# EAGLE design seismo (EAGLE 7.2.0)
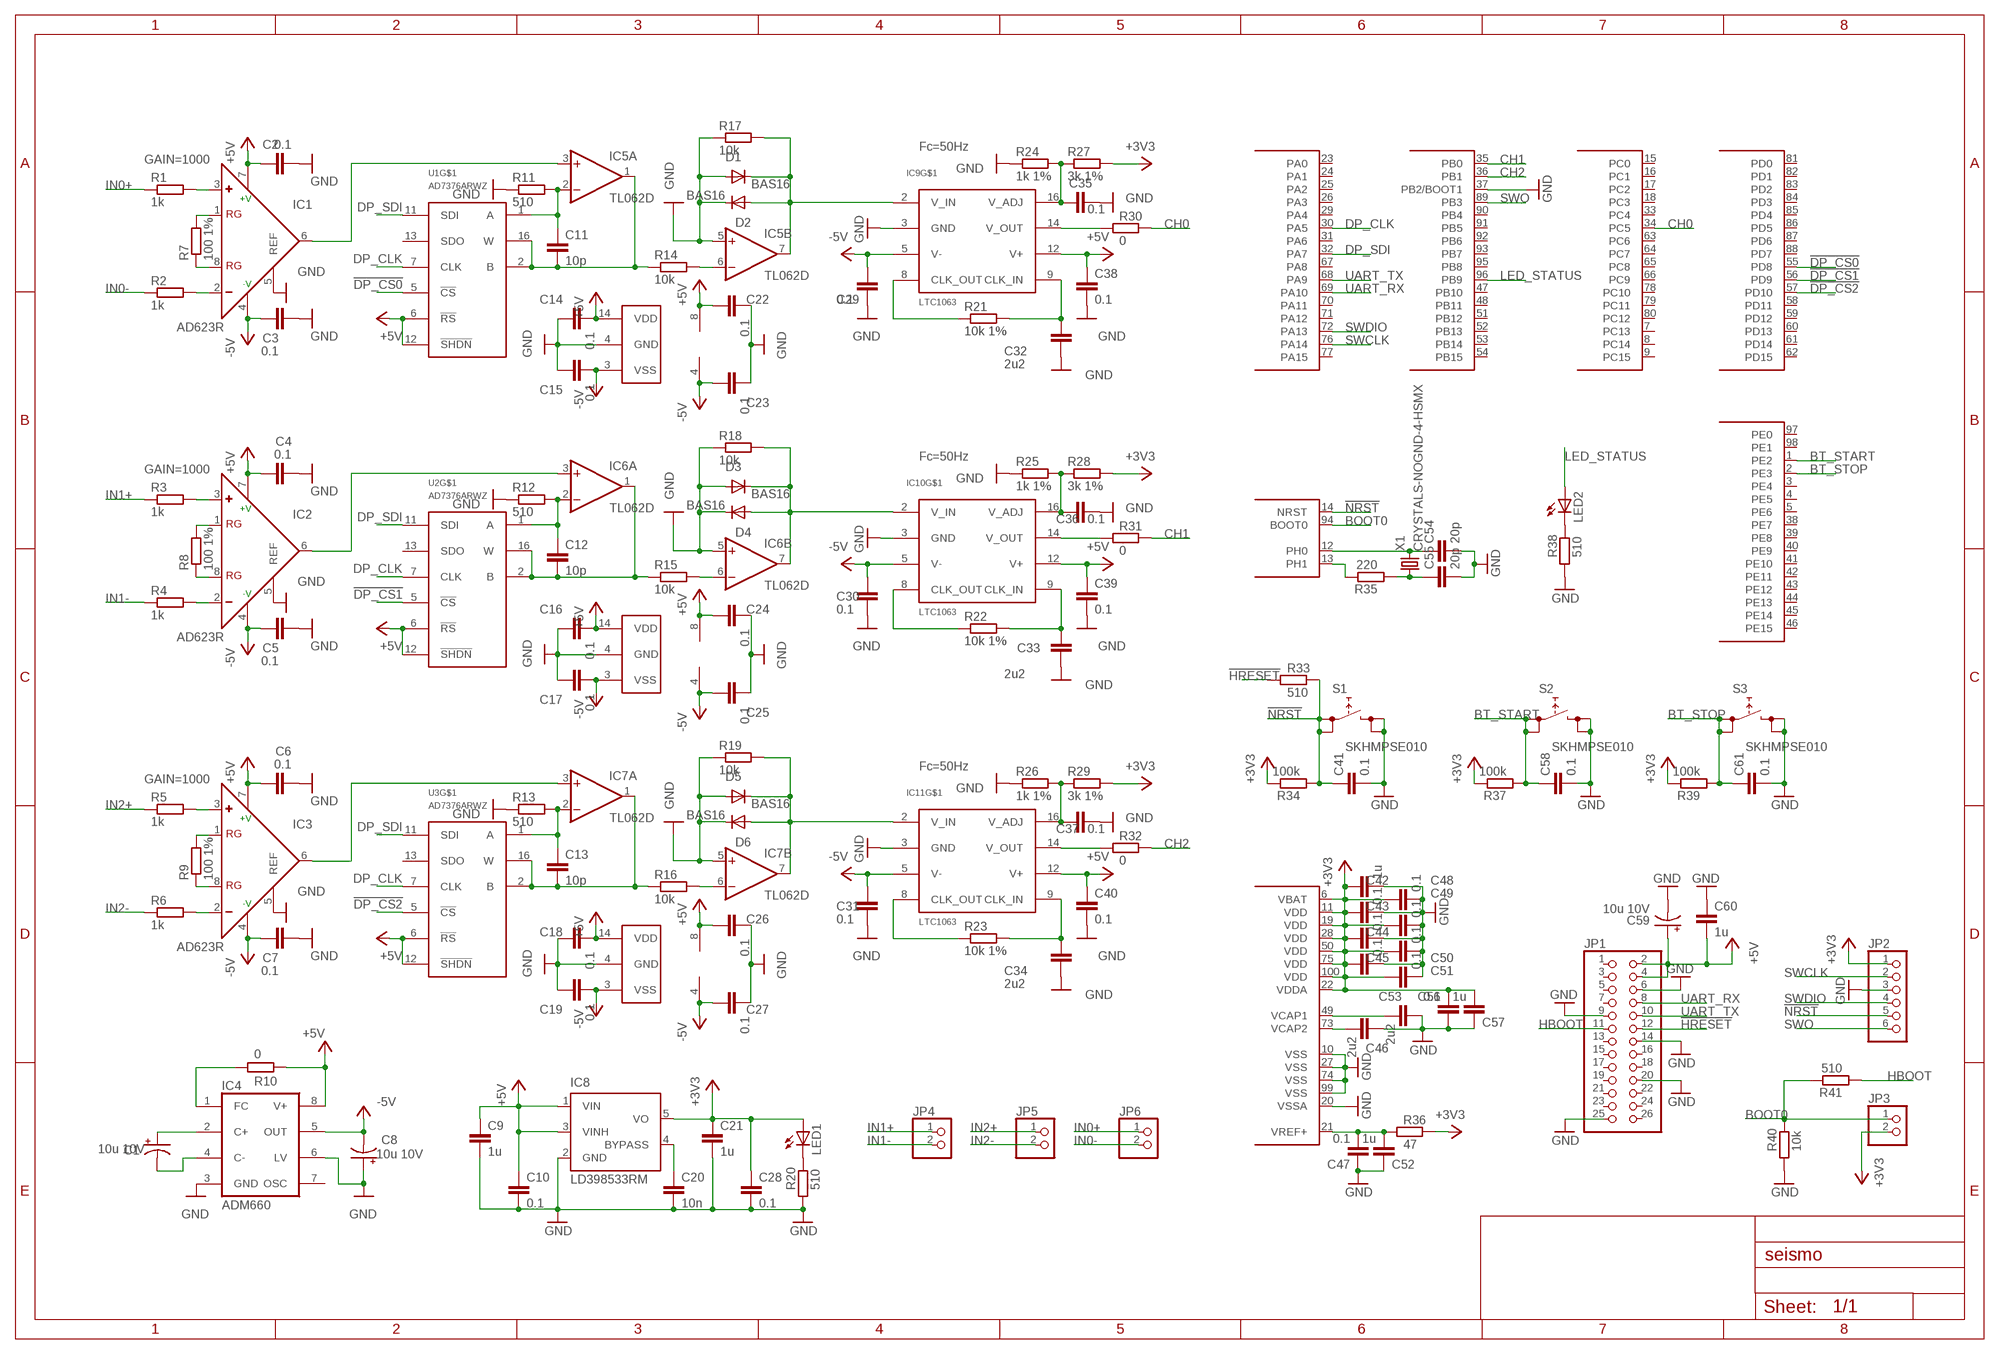
[diagram p0: schematic, sheet 1]

## Parts
C1  10u 10V  CPOL-USSMCA  [SMC_A]
C2  0.1  C-EUC0805  [C0805]
C3  0.1  C-EUC0805  [C0805]
C4  0.1  C-EUC0805  [C0805]
C5  0.1  C-EUC0805  [C0805]
C6  0.1  C-EUC0805  [C0805]
C7  0.1  C-EUC0805  [C0805]
C8  10u 10V  CPOL-USSMCA  [SMC_A]
C9  1u  C-EUC0805  [C0805]
C10  0.1  C-EUC0805  [C0805]
C11  10p  C-EUC0805  [C0805]
C12  10p  C-EUC0805  [C0805]
C13  10p  C-EUC0805  [C0805]
C14  0.1  C-EUC0805  [C0805]
C15  0.1  C-EUC0805  [C0805]
C16  0.1  C-EUC0805  [C0805]
C17  0.1  C-EUC0805  [C0805]
C18  0.1  C-EUC0805  [C0805]
C19  0.1  C-EUC0805  [C0805]
C20  10n  C-EUC0805  [C0805]
C21  1u  C-EUC0805  [C0805]
C22  0.1  C-EUC0805  [C0805]
C23  0.1  C-EUC0805  [C0805]
C24  0.1  C-EUC0805  [C0805]
C25  0.1  C-EUC0805  [C0805]
C26  0.1  C-EUC0805  [C0805]
C27  0.1  C-EUC0805  [C0805]
C28  0.1  C-EUC0805  [C0805]
C29  0.1  C-EUC0805  [C0805]
C30  0.1  C-EUC0805  [C0805]
C31  0.1  C-EUC0805  [C0805]
C32  2u2  C-EUC0805  [C0805]
C33  2u2  C-EUC0805  [C0805]
C34  2u2  C-EUC0805  [C0805]
C35  0.1  C-EUC0805  [C0805]
C36  0.1  C-EUC0805  [C0805]
C37  0.1  C-EUC0805  [C0805]
C38  0.1  C-EUC0805  [C0805]
C39  0.1  C-EUC0805  [C0805]
C40  0.1  C-EUC0805  [C0805]
C41  0.1  C-EUC0805  [C0805]
C42  1u  C-EUC0805  [C0805]
C43  0.1  C-EUC0805  [C0805]
C44  0.1  C-EUC0805  [C0805]
C45  0.1  C-EUC0805  [C0805]
C46  2u2  C-EUC0805  [C0805]
C47  0.1  C-EUC0805  [C0805]
C48  0.1  C-EUC0805  [C0805]
C49  0.1  C-EUC0805  [C0805]
C50  0.1  C-EUC0805  [C0805]
C51  0.1  C-EUC0805  [C0805]
C52  1u  C-EUC0805  [C0805]
C53  2u2  C-EUC0805  [C0805]
C54  20p  C-EUC0805  [C0805]
C55  20p  C-EUC0805  [C0805]
C56  0.1  C-EUC0805  [C0805]
C57  1u  C-EUC0805  [C0805]
C58  0.1  C-EUC0805  [C0805]
C59  10u 10V  CPOL-USSMCA  [SMC_A]
C60  1u  C-EUC0805  [C0805]
C61  0.1  C-EUC0805  [C0805]
D1  BAS16  [SOT23]
D2  BAS16  [SOT23]
D3  BAS16  [SOT23]
D4  BAS16  [SOT23]
D5  BAS16  [SOT23]
D6  BAS16  [SOT23]
IC1  AD623R  [SO8]
IC2  AD623R  [SO8]
IC3  AD623R  [SO8]
IC4  ADM660  [SO8]
IC5  TL062D  [SO08]
IC6  TL062D  [SO08]
IC7  TL062D  [SO08]
IC8  LD398533RM  [SOT23-5L]
IC9  LTC1063  [SOIC127P1032X264-16N]
IC10  LTC1063  [SOIC127P1032X264-16N]
IC11  LTC1063  [SOIC127P1032X264-16N]
JP1  PINHD-2X13  [2X13]
JP2  PINHD-1X6  [1X06]
JP3  PINHD-1X2  [1X02]
JP4  PINHD-1X2  [1X02]
JP5  PINHD-1X2  [1X02]
JP6  PINHD-1X2  [1X02]
LED1  LEDCHIPLED_1206  [CHIPLED_1206]
LED2  LEDCHIPLED_1206  [CHIPLED_1206]
R1  1k  R-EU_R0805W  [R0805W]
R2  1k  R-EU_R0805W  [R0805W]
R3  1k  R-EU_R0805W  [R0805W]
R4  1k  R-EU_R0805W  [R0805W]
R5  1k  R-EU_R0805W  [R0805W]
R6  1k  R-EU_R0805W  [R0805W]
R7  100 1%  R-EU_R0805W  [R0805W]
R8  100 1%  R-EU_R0805W  [R0805W]
R9  100 1%  R-EU_R0805W  [R0805W]
R10  0  R-EU_R0805W  [R0805W]
R11  510  R-EU_R0805W  [R0805W]
R12  510  R-EU_R0805W  [R0805W]
R13  510  R-EU_R0805W  [R0805W]
R14  10k  R-EU_R0805W  [R0805W]
R15  10k  R-EU_R0805W  [R0805W]
R16  10k  R-EU_R0805W  [R0805W]
R17  10k  R-EU_R0805W  [R0805W]
R18  10k  R-EU_R0805W  [R0805W]
R19  10k  R-EU_R0805W  [R0805W]
R20  510  R-EU_R0805W  [R0805W]
R21  10k 1%  R-EU_R0805W  [R0805W]
R22  10k 1%  R-EU_R0805W  [R0805W]
R23  10k 1%  R-EU_R0805W  [R0805W]
R24  1k 1%  R-EU_R0805W  [R0805W]
R25  1k 1%  R-EU_R0805W  [R0805W]
R26  1k 1%  R-EU_R0805W  [R0805W]
R27  3k 1%  R-EU_R0805W  [R0805W]
R28  3k 1%  R-EU_R0805W  [R0805W]
R29  3k 1%  R-EU_R0805W  [R0805W]
R30  0  R-EU_R0805W  [R0805W]
R31  0  R-EU_R0805W  [R0805W]
R32  0  R-EU_R0805W  [R0805W]
R33  510  R-EU_R0805W  [R0805W]
R34  100k  R-EU_R0805W  [R0805W]
R35  220  R-EU_R0805W  [R0805W]
R36  47  R-EU_R0805W  [R0805W]
R37  100k  R-EU_R0805W  [R0805W]
R38  510  R-EU_R0805W  [R0805W]
R39  100k  R-EU_R0805W  [R0805W]
R40  10k  R-EU_R0805W  [R0805W]
R41  510  R-EU_R0805W  [R0805W]
S1  SKHMPSE010  [SKHMPXE010]
S2  SKHMPSE010  [SKHMPXE010]
S3  SKHMPSE010  [SKHMPXE010]
U1  AD7376ARWZ  [SO-16W]
U2  AD7376ARWZ  [SO-16W]
U3  AD7376ARWZ  [SO-16W]
U4  STM32F4-100  [SQFP-S-14X14-100]
X1  CRYSTALS-NOGND-4-HSMX  [HC49-4-HSMX]

## Nets
!DP_CS0: U1.5(!CS) U4.55(PD8)
!DP_CS1: U2.5(!CS) U4.56(PD9)
!DP_CS2: U3.5(!CS) U4.57(PD10)
!HRESET: JP1.12 R33.1
!NRST: C41.1 JP2.5 R33.2 R34.1 S1.1(1.1) S1.2(1.2) U4.14(NRST)
+3V3: C21.1 C28.1 C42.1 C43.1 C44.1 C45.1 C48.1 C49.1 C50.1 C51.1 C56.2 C57.2 IC8.5(VO) JP2.1 JP3.2 LED1.A R27.2 R28.2 R29.2 R34.2 R36.2 R37.2 R39.2 U4.6(VBAT) U4.11(VDD) U4.19(VDD) U4.22(VDDA) U4.28(VDD) U4.50(VDD) U4.75(VDD) U4.100(VDD)
+5V: C2.1 C4.1 C6.1 C9.1 C10.1 C14.2 C16.2 C18.2 C22.1 C24.1 C26.1 C38.1 C39.1 C40.1 C59.+ C60.2 IC1.7(+V) IC2.7(+V) IC3.7(+V) IC4.8(V+) IC5.8(P:V+) IC6.8(P:V+) IC7.8(P:V+) IC8.1(VIN) IC8.3(VINH) IC9.12(V+) IC10.12(V+) IC11.12(V+) JP1.2 JP1.4 R10.2 U1.6(!RS) U1.12(!SHDN) U1.14(VDD) U2.6(!RS) U2.12(!SHDN) U2.14(VDD) U3.6(!RS) U3.12(!SHDN) U3.14(VDD)
-5V: C3.1 C5.1 C7.1 C8.- C15.2 C17.2 C19.2 C23.1 C25.1 C27.1 C29.1 C30.1 C31.1 IC1.4(-V) IC2.4(-V) IC3.4(-V) IC4.5(OUT) IC5.4(P:V-) IC6.4(P:V-) IC7.4(P:V-) IC9.5(V-) IC10.5(V-) IC11.5(V-) U1.3(VSS) U2.3(VSS) U3.3(VSS)
BOOT0: JP3.1 R40.2 R41.2 U4.94(BOOT0)
BT_START: C58.1 R37.1 S2.1(1.1) S2.2(1.2) U4.1(PE2)
BT_STOP: C61.1 R39.1 S3.1(1.1) S3.2(1.2) U4.2(PE3)
CH0: R30.2 U4.34(PC5)
CH1: R31.2 U4.35(PB0)
CH2: R32.2 U4.36(PB1)
DP_CLK: U1.7(CLK) U2.7(CLK) U3.7(CLK) U4.30(PA5)
DP_SDI: U1.11(SDI) U2.11(SDI) U3.11(SDI) U4.32(PA7)
GND: C2.2 C3.2 C4.2 C5.2 C6.2 C7.2 C8.+ C9.2 C10.2 C14.1 C15.1 C16.1 C17.1 C18.1 C19.1 C20.2 C21.2 C22.2 C23.2 C24.2 C25.2 C26.2 C27.2 C28.2 C29.2 C30.2 C31.2 C32.2 C33.2 C34.2 C35.2 C36.2 C37.2 C38.2 C39.2 C40.2 C41.2 C42.2 C43.2 C44.2 C45.2 C46.1 C47.1 C48.2 C49.2 C50.2 C51.2 C52.1 C53.1 C54.2 C55.2 C56.1 C57.1 C58.2 C59.- C60.1 C61.2 D1.1(A) D2.3(C) D3.1(A) D4.3(C) D5.1(A) D6.3(C) IC1.5(REF) IC2.5(REF) IC3.5(REF) IC4.3(GND) IC4.6(LV) IC5.5(B:+IN) IC6.5(B:+IN) IC7.5(B:+IN) IC8.2(GND) IC9.3(GND) IC10.3(GND) IC11.3(GND) JP1.6 JP1.9 JP1.14 JP1.20 JP1.25 JP2.3 R11.1 R12.1 R13.1 R17.1 R18.1 R19.1 R20.1 R24.1 R25.1 R26.1 R38.1 R40.1 S1.3(2.1) S1.4(2.2) S2.3(2.1) S2.4(2.2) S3.3(2.1) S3.4(2.2) U1.4(GND) U2.4(GND) U3.4(GND) U4.10(VSS) U4.20(VSSA) U4.27(VSS) U4.37(PB2/BOOT1) U4.74(VSS) U4.99(VSS)
HBOOT: JP1.11 R41.1
IN0+: JP6.1 R1.1
IN0-: JP6.2 R2.1
IN1+: JP4.1 R3.1
IN1-: JP4.2 R4.1
IN2+: JP5.1 R5.1
IN2-: JP5.2 R6.1
LED_STATUS: LED2.A U4.96(PB9)
N$1: IC1.2(-) R2.2
N$2: IC1.8(RG) R7.1
N$3: IC1.1(RG) R7.2
N$4: IC1.3(+) R1.2
N$5: C55.1 R35.1 X1.1
N$6: IC9.8(CLK_OUT) R21.1
N$7: C32.1 IC9.9(CLK_IN) R21.2
N$8: C35.1 IC9.16(V_ADJ) R24.2 R27.1
N$9: R35.2 U4.13(PH1)
N$10: IC9.14(V_OUT) R30.1
N$11: C1.+ IC4.2(C+)
N$12: IC10.8(CLK_OUT) R22.1
N$13: C33.1 IC10.9(CLK_IN) R22.2
N$14: IC2.2(-) R4.2
N$15: IC2.8(RG) R8.1
N$16: IC2.1(RG) R8.2
N$17: IC2.3(+) R3.2
N$18: C36.1 IC10.16(V_ADJ) R25.2 R28.1
N$19: IC10.14(V_OUT) R31.1
N$20: C1.- IC4.4(C-)
N$21: C53.2 U4.49(VCAP1)
N$22: IC11.8(CLK_OUT) R23.1
N$23: C34.1 IC11.9(CLK_IN) R23.2
N$24: IC3.2(-) R6.2
N$25: IC3.8(RG) R9.1
N$26: IC3.1(RG) R9.2
N$27: IC3.3(+) R5.2
N$28: C37.1 IC11.16(V_ADJ) R26.2 R29.1
N$29: IC11.14(V_OUT) R32.1
N$30: IC4.1(FC) R10.1
N$31: C11.2 IC5.1(A:OUT) R14.1 U1.2(B) U1.16(W)
N$32: IC1.6(OUT) IC5.3(A:+IN)
N$33: C11.1 IC5.2(A:-IN) R11.2 U1.1(A)
N$34: IC5.6(B:-IN) R14.2
N$35: C20.1 IC8.4(BYPASS)
N$36: D1.3(C) D2.1(A) IC5.7(B:OUT) IC9.2(V_IN) R17.2
N$37: C46.2 U4.73(VCAP2)
N$40: C12.2 IC6.1(A:OUT) R15.1 U2.2(B) U2.16(W)
N$41: IC2.6(OUT) IC6.3(A:+IN)
N$42: C12.1 IC6.2(A:-IN) R12.2 U2.1(A)
N$43: IC6.6(B:-IN) R15.2
N$44: D3.3(C) D4.1(A) IC6.7(B:OUT) IC10.2(V_IN) R18.2
N$47: C13.2 IC7.1(A:OUT) R16.1 U3.2(B) U3.16(W)
N$48: IC3.6(OUT) IC7.3(A:+IN)
N$49: C13.1 IC7.2(A:-IN) R13.2 U3.1(A)
N$50: IC7.6(B:-IN) R16.2
N$51: D5.3(C) D6.1(A) IC7.7(B:OUT) IC11.2(V_IN) R19.2
N$54: C54.1 U4.12(PH0) X1.2
N$56: LED1.C R20.2
N$57: LED2.C R38.2
SWCLK: JP2.2 U4.76(PA14)
SWDIO: JP2.4 U4.72(PA13)
SWO: JP2.6 U4.89(PB3)
UART_RX: JP1.8 U4.69(PA10)
UART_TX: JP1.10 U4.68(PA9)
VREF: C47.2 C52.2 R36.1 U4.21(VREF+)
Unconnected: IC4.7(OSC) IC9.1(NC1) IC9.4(NC2) IC9.6(NC3) IC9.7(NC4) IC9.10(NC5) IC9.11(NC6) IC9.13(NC7) IC9.15(NC8) IC10.1(NC1) IC10.4(NC2) IC10.6(NC3) IC10.7(NC4) IC10.10(NC5) IC10.11(NC6) IC10.13(NC7) IC10.15(NC8) IC11.1(NC1) IC11.4(NC2) IC11.6(NC3) IC11.7(NC4) IC11.10(NC5) IC11.11(NC6) IC11.13(NC7) IC11.15(NC8) JP1.1 JP1.3 JP1.5 JP1.7 JP1.13 JP1.15 JP1.16 JP1.17 JP1.18 JP1.19 JP1.21 JP1.22 JP1.23 JP1.24 JP1.26 U1.8(NC0) U1.9(NC1) U1.10(NC2) U1.13(SDO) U1.15(NC3) U2.8(NC0) U2.9(NC1) U2.10(NC2) U2.13(SDO) U2.15(NC3) U3.8(NC0) U3.9(NC1) U3.10(NC2) U3.13(SDO) U3.15(NC3) U4.3(PE4) U4.4(PE5) U4.5(PE6) U4.7(PC13) U4.8(PC14) U4.9(PC15) U4.15(PC0) U4.16(PC1) U4.17(PC2) U4.18(PC3) U4.23(PA0) U4.24(PA1) U4.25(PA2) U4.26(PA3) U4.29(PA4) U4.31(PA6) U4.33(PC4) U4.38(PE7) U4.39(PE8) U4.40(PE9) U4.41(PE10) U4.42(PE11) U4.43(PE12) U4.44(PE13) U4.45(PE14) U4.46(PE15) U4.47(PB10) U4.48(PB11) U4.51(PB12) U4.52(PB13) U4.53(PB14) U4.54(PB15) U4.58(PD11) U4.59(PD12) U4.60(PD13) U4.61(PD14) U4.62(PD15) U4.63(PC6) U4.64(PC7) U4.65(PC8) U4.66(PC9) U4.67(PA8) U4.70(PA11) U4.71(PA12) U4.77(PA15) U4.78(PC10) U4.79(PC11) U4.80(PC12) U4.81(PD0) U4.82(PD1) U4.83(PD2) U4.84(PD3) U4.85(PD4) U4.86(PD5) U4.87(PD6) U4.88(PD7) U4.90(PB4) U4.91(PB5) U4.92(PB6) U4.93(PB7) U4.95(PB8) U4.97(PE0) U4.98(PE1)

## Notes on the sheet
- Fc=50Hz
- GAIN=1000
- Fc=50Hz
- GAIN=1000
- Fc=50Hz
- GAIN=1000

## Library data of the parts
C1 C8 C59 = rcl:CPOL-US: POLARIZED CAPACITOR, American symbol
C2-C7 C9-C58 C60 C61 = rcl:C-EU: CAPACITOR, European symbol
D1-D6 = seismo:BAS16
IC1-IC3 = analog-devices:AD623: Single-Supply, Rail-to-Rail, Low Cost Instrumentation Amplifier Source: http://www.analog.com/static/imported-files/data_sheets/AD623.pdf; MPN: AD623ARZ.; OC_FARNELL: 9426213; OC_NEWARK: 31M4186
IC4 = seismo:ADM660
IC5-IC7 = linear:TL062: OP AMP
IC8 = st-microelectronics:LD3985: Ultra low drop and low noise BiCMOS voltage regulators Source: www.st.com LD3985.pdf
IC9-IC11 = seismo:LTC1063
JP1 = seismo:PINHD-2X13: PIN HEADER
JP2 = pinhead:PINHD-1X6: PIN HEADER
JP3-JP6 = seismo:PINHD-1X2: PIN HEADER
LED1 LED2 = led:LED: LED OSRAM: - CHIPLED LG R971, LG N971, LY N971, LG Q971, LY Q971, LO R971, LY R971 LH N974, LH R974 LS Q976, LO Q976, LY Q976 LO Q996 - Hyper CHIPLED LW Q18S LB Q993, LB Q99A, LB R99A - SideLED LS A670, LO A670, LY A670, LG A670, LP A670 LB A673, LV A673, LT A673, LW A673 LH A674 LY A675 LS A676, LA A676, LO A676, LY A676, LW A676 LS A679, LY A679, LG A679 - Hyper Micro SIDELED® LS Y876, LA Y876, LO Y876, LY Y876 LT Y87S - SmartLED LW L88C, LW L88S LB L89C, LB L89S, LG L890 LS L89K, LO L89K, LY L89K LS L896, LA L896, LO L896, LY L896 - TOPLED LS T670, LO T670, LY T670, LG T670, LP T670 LSG T670, LSP T670, LSY T670, LOP T670, LYG T670 LG T671, LOG T671, LSG T671 LB T673, LV T673, LT T673, LW T673 LH T674 LS T676, LA T676, LO T676, LY T676, LB T676, LH T676, LSB T676, LW T676 LB T67C, LV T67C, LT T67C, LS T67K, LO T67K, LY T67K, LW E67C LS E67B, LA E67B, LO E67B, LY E67B, LB E67C, LV E67C, LT E67C LW T67C LS T679, LY T679, LG T679 LS T770, LO T770, LY T770, LG T770, LP T770 LB T773, LV T773, LT T773, LW T773 LH T774 LS E675, LA E675, LY E675, LS T675 LS T776, LA T776, LO T776, LY T776, LB T776 LHGB T686 LT T68C, LB T68C - Hyper Mini TOPLED® LB M676 - Mini TOPLED Santana® LG M470 LS M47K, LO M47K, LY M47K Source: http://www.osram.convergy.de LUXEON: - LUMILED® LXK2-PW12-R00, LXK2-PW12-S00, LXK2-PW14-U00, LXK2-PW14-V00 LXK2-PM12-R00, LXK2-PM12-S00, LXK2-PM14-U00 LXK2-PE12-Q00, LXK2-PE12-R00, LXK2-PE12-S00, LXK2-PE14-T00, LXK2-PE14-U00 LXK2-PB12-K00, LXK2-PB12-L00, LXK2-PB12-M00, LXK2-PB14-N00, LXK2-PB14-P00, LXK2-PB14-Q00 LXK2-PR12-L00, LXK2-PR12-M00, LXK2-PR14-Q00, LXK2-PR14-R00 LXK2-PD12-Q00, LXK2-PD12-R00, LXK2-PD12-S00 LXK2-PH12-R00, LXK2-PH12-S00 LXK2-PL12-P00, LXK2-PL12-Q00, LXK2-PL12-R00 Source: www.luxeon.com KINGBRIGHT: KA-3528ASYC Source: www.kingbright.com
R1-R41 = rcl:R-EU_: RESISTOR, European symbol
S1-S3 = seismo:SKHMP*E010: 6.2 X 6.5mm TACT Switch (SMD) Source: http://www3.alps.co.jp/WebObjects/catalog.woa/PDF/E/Switch/Tact/SKHM/SKHM.PDF
U1-U3 = seismo:AD7376ARWZ
U4 = apbteam_stm32:STM32F4-100: STM32F4, 100 pin package According to STM32F40x datasheet, almost compatible with STM32F4xx, STM32F2xx, some pins must be connected differently, see chapter 2.1.
X1 = IQD-Frequency-Products:CRYSTALS-NOGND: CRYSTALS CAN NOT GROUNDED

## Board
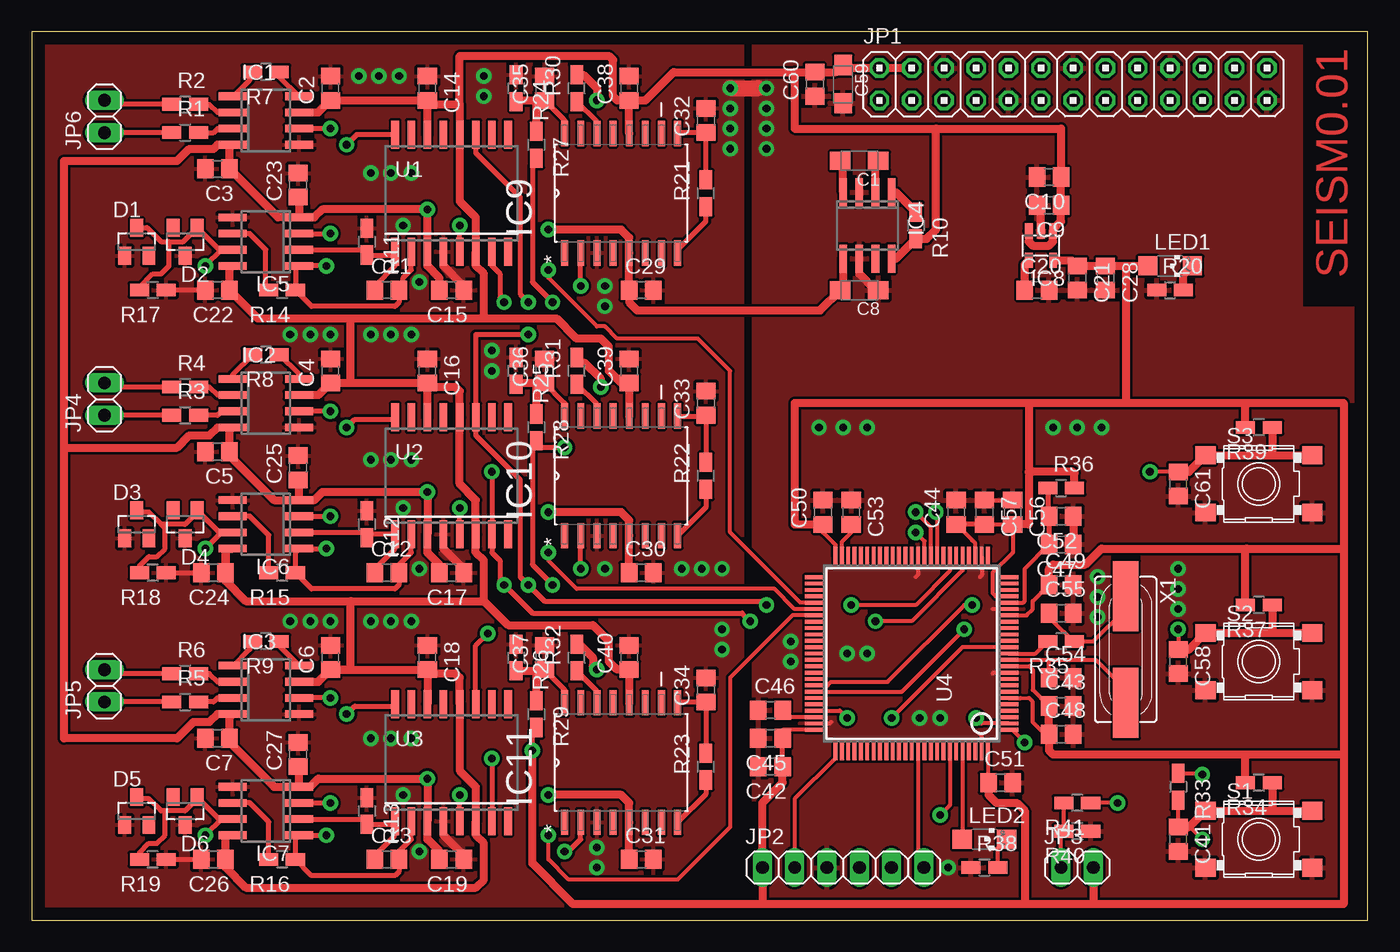
[diagram p1: board, top side]
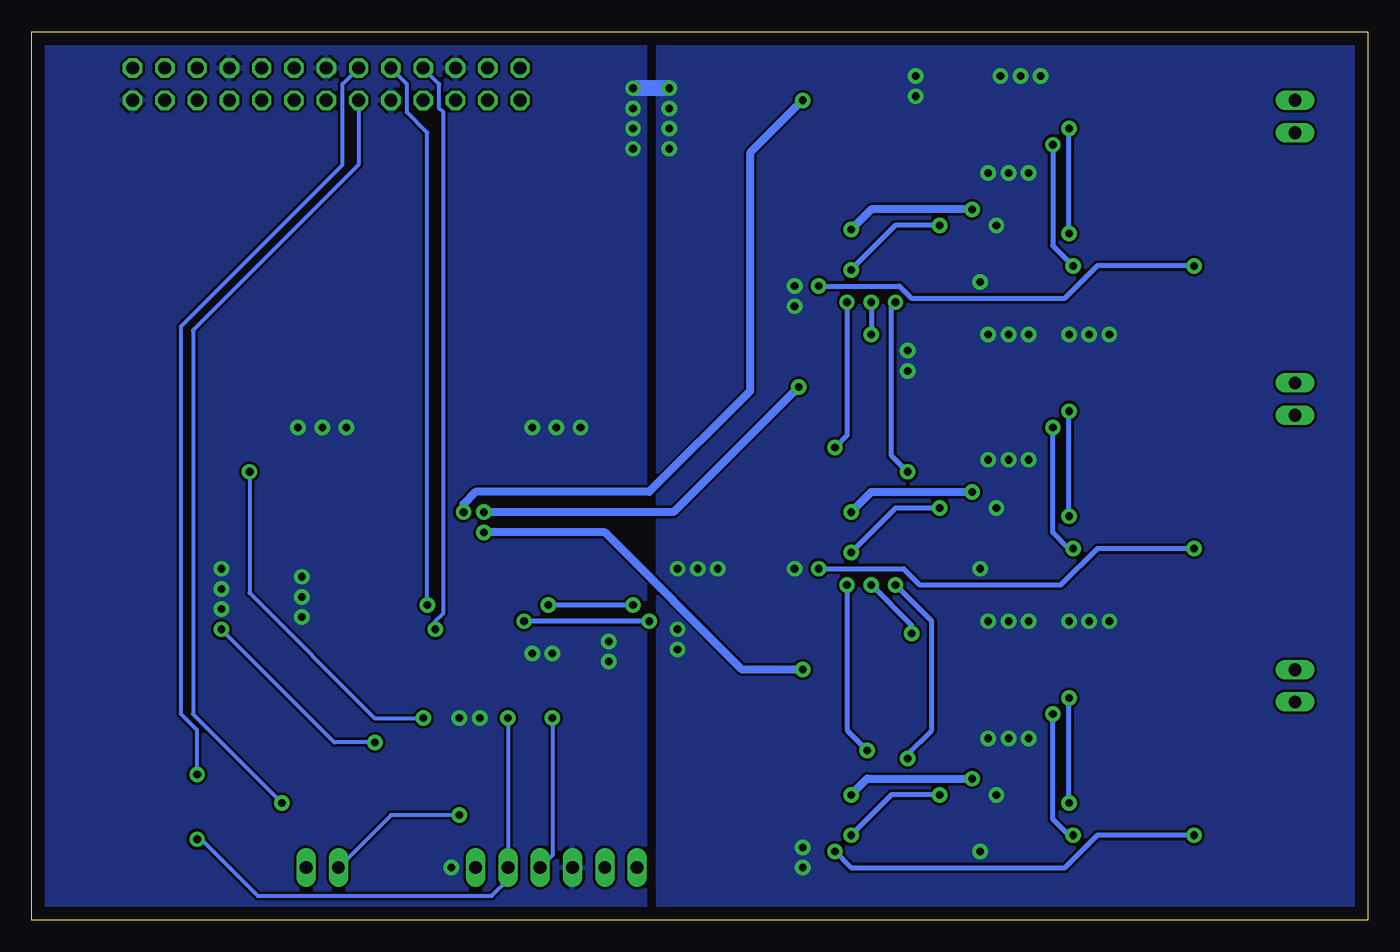
[diagram p2: board, bottom side, seen from below]

Size 105.08 x 69.84 mm. Coordinates in mm from the lower left corner, seen from the top.
Outline: 0,0 105.08,0 105.08,69.84 0,69.84 0,0
Copper layers (1*16): Top 0.035mm / dielectric 1.5mm / Bottom 0.035mm
Design rules "default *": minimum track width 10mil, minimum drill 20mil, track to track 8mil, track to pad 8mil, pad to pad 8mil, via to via 8mil, smd to smd 8mil, copper to edge 40mil, drill to drill 8mil, minimum pad ring 10mil, minimum via ring 12mil, stop-mask expansion 4mil, vias tented up to drill 0mil, thermal gap 10mil
tRestrict: area 100,48.3 to 104.8,69.5

### Footprints (pad centres in the part's own frame; a part is rotated, then mirrored left to right if it is on the bottom)
SMC_A = smd 1.6 x 1.4: + -1.5,0; - 1.5,0
C0805 = smd 1.3 x 1.5: 1 -0.95,0; 2 0.95,0
SOT23 = smd 1 x 1.4: 1 -0.95,-1.1; 2 0.95,-1.1; 3 0,1.1
SO8 = smd 0.6 x 2.2: 1 -1.905,-2.6; 2 -0.635,-2.6; 3 0.635,-2.6; 4 1.905,-2.6; 5 1.905,2.6; 6 0.635,2.6; 7 -0.635,2.6; 8 -1.905,2.6
SO08 = smd 0.6 x 2.2: 1 -1.905,-2.6; 2 -0.635,-2.6; 3 0.635,-2.6; 4 1.905,-2.6; 5 1.905,2.6; 6 0.635,2.6; 7 -0.635,2.6; 8 -1.905,2.6
SOT23-5L = smd 0.6 x 1.2: 1 -0.95,-1.15; 2 0,-1.15; 3 0.95,-1.15; 4 0.95,1.15; 5 -0.95,1.15
SOIC127P1032X264-16N = smd 1.981 x 0.533: 1 -4.699,4.445; 2 -4.699,3.175; 3 -4.699,1.905; 4 -4.699,0.635; 5 -4.699,-0.635; 6 -4.699,-1.905; 7 -4.699,-3.175; 8 -4.699,-4.445; 9 4.699,-4.445; 10 4.699,-3.175; 11 4.699,-1.905; 12 4.699,-0.635; 13 4.699,0.635; 14 4.699,1.905; 15 4.699,3.175; 16 4.699,4.445
2X13 = drill 1.016 octagon: 1 -15.24,-1.27; 2 -15.24,1.27; 3 -12.7,-1.27; 4 -12.7,1.27; 5 -10.16,-1.27; 6 -10.16,1.27; 7 -7.62,-1.27; 8 -7.62,1.27; 9 -5.08,-1.27; 10 -5.08,1.27; 11 -2.54,-1.27; 12 -2.54,1.27; 13 0,-1.27; 14 0,1.27; 15 2.54,-1.27; 16 2.54,1.27; 17 5.08,-1.27; 18 5.08,1.27; 19 7.62,-1.27; 20 7.62,1.27; 21 10.16,-1.27; 22 10.16,1.27; 23 12.7,-1.27; 24 12.7,1.27; 25 15.24,-1.27; 26 15.24,1.27
1X06 = drill 1.016 long: 1 -6.35,0; 2 -3.81,0; 3 -1.27,0; 4 1.27,0; 5 3.81,0; 6 6.35,0
1X02 = drill 1.016 long: 1 -1.27,0; 2 1.27,0
CHIPLED_1206 = smd 1.5 x 1.5: A 0,-1.75; C 0,1.75
R0805W = smd 1.5 x 1: 1 -1.052,0; 2 1.052,0
SKHMPXE010 = smd 1.6 x 1.4: 1 -4.2,2.25; 2 4.2,2.25; 3 -4.2,-2.25; 4 4.2,-2.25
SO-16W = smd 0.6 x 2.2: 1 -4.445,-4.6; 2 -3.175,-4.6; 3 -1.905,-4.6; 4 -0.635,-4.6; 5 0.635,-4.6; 6 1.905,-4.6; 7 3.175,-4.6; 8 4.445,-4.6; 9 4.445,4.6; 10 3.175,4.6; 11 1.905,4.6; 12 0.635,4.6; 13 -0.635,4.6; 14 -1.905,4.6; 15 -3.175,4.6; 16 -4.445,4.6
SQFP-S-14X14-100 = smd 0.3 x 1.6: 1 -6,-7.6; 2 -5.5,-7.6; 3 -5,-7.6; 4 -4.5,-7.6; 5 -4,-7.6; 6 -3.5,-7.6; 7 -3,-7.6; 8 -2.5,-7.6; 9 -2,-7.6; 10 -1.5,-7.6; 11 -1,-7.6; 12 -0.5,-7.6; 13 0,-7.6; 14 0.5,-7.6; 15 1,-7.6; 16 1.5,-7.6; 17 2,-7.6; 18 2.5,-7.6; 19 3,-7.6; 20 3.5,-7.6; 21 4,-7.6; 22 4.5,-7.6; 23 5,-7.6; 24 5.5,-7.6; 25 6,-7.6; 51 6,7.6; 52 5.5,7.6; 53 5,7.6; 54 4.5,7.6; 55 4,7.6; 56 3.5,7.6; 57 3,7.6; 58 2.5,7.6; 59 2,7.6; 60 1.5,7.6; 61 1,7.6; 62 0.5,7.6; 63 0,7.6; 64 -0.5,7.6; 65 -1,7.6; 66 -1.5,7.6; 67 -2,7.6; 68 -2.5,7.6; 69 -3,7.6; 70 -3.5,7.6; 71 -4,7.6; 72 -4.5,7.6; 73 -5,7.6; 74 -5.5,7.6; 75 -6,7.6 | smd 1.6 x 0.3: 26 7.6,-6; 27 7.6,-5.5; 28 7.6,-5; 29 7.6,-4.5; 30 7.6,-4; 31 7.6,-3.5; 32 7.6,-3; 33 7.6,-2.5; 34 7.6,-2; 35 7.6,-1.5; 36 7.6,-1; 37 7.6,-0.5; 38 7.6,0; 39 7.6,0.5; 40 7.6,1; 41 7.6,1.5; 42 7.6,2; 43 7.6,2.5; 44 7.6,3; 45 7.6,3.5; 46 7.6,4; 47 7.6,4.5; 48 7.6,5; 49 7.6,5.5; 50 7.6,6; 76 -7.6,6; 77 -7.6,5.5; 78 -7.6,5; 79 -7.6,4.5; 80 -7.6,4; 81 -7.6,3.5; 82 -7.6,3; 83 -7.6,2.5; 84 -7.6,2; 85 -7.6,1.5; 86 -7.6,1; 87 -7.6,0.5; 88 -7.6,0; 89 -7.6,-0.5; 90 -7.6,-1; 91 -7.6,-1.5; 92 -7.6,-2; 93 -7.6,-2.5; 94 -7.6,-3; 95 -7.6,-3.5; 96 -7.6,-4; 97 -7.6,-4.5; 98 -7.6,-5; 99 -7.6,-5.5; 100 -7.6,-6
HC49-4-HSMX = smd 5.5 x 2: 1 -4.2,0; 2 4.2,0

### Placement (x,y rotation side)
C1  65.09,59.69 180 top
C2  23.5,65.41 90 top
C3  14.61,59.05 180 top
C4  23.5,43.18 90 top
C5  14.61,36.83 180 top
C6  23.5,20.64 90 top
C7  14.61,14.29 180 top
C8  65.09,49.53 180 top
C9  80.01,56.2 180 top
C10  80.01,58.42 180 top
C11  27.94,49.53 0 top
C12  27.94,27.3 0 top
C13  27.94,4.76 0 top
C14  31.11,65.41 270 top
C15  33.02,49.53 180 top
C16  31.11,43.18 270 top
C17  33.02,27.3 180 top
C18  31.11,20.64 270 top
C19  33.02,4.76 180 top
C20  79.06,49.53 0 top
C21  82.23,50.48 270 top
C22  14.61,49.53 180 top
C23  20.95,57.78 90 top
C24  14.29,27.3 180 top
C25  20.95,35.56 90 top
C26  14.29,4.76 180 top
C27  20.95,13.02 90 top
C28  84.45,50.48 270 top
C29  47.94,49.53 0 top
C30  47.94,27.3 0 top
C31  47.94,4.76 0 top
C32  53.02,62.87 90 top
C33  53.02,40.64 90 top
C34  53.02,18.1 90 top
C35  40.32,65.41 90 top
C36  40.32,43.18 90 top
C37  40.32,20.64 90 top
C38  46.99,65.41 90 top
C39  46.99,43.18 90 top
C40  46.99,20.64 90 top
C41  90.17,6.35 270 top
C42  58.1,12.06 180 top
C43  80.96,16.83 0 top
C44  72.71,32.07 90 top
C45  58.1,14.29 180 top
C46  58.1,16.51 0 top
C47  80.96,29.53 180 top
C48  80.96,14.61 0 top
C49  80.96,26.35 0 top
C50  62.23,32.07 90 top
C51  76.2,10.79 0 top
C52  80.96,31.75 180 top
C53  64.45,32.07 270 top
C54  80.96,19.05 0 top
C55  80.96,24.13 0 top
C56  77.15,32.07 270 top
C57  74.93,32.07 270 top
C58  90.17,20.32 270 top
C59  63.82,65.72 270 top
C60  61.59,65.72 90 top
C61  90.17,34.29 270 top
D1  8.26,53.34 0 top
D2  12.06,53.34 180 top
D3  8.26,31.11 0 top
D4  12.06,31.11 180 top
D5  8.26,8.57 0 top
D6  12.06,8.57 180 top
IC1  18.41,62.87 270 top
IC2  18.41,40.64 270 top
IC3  18.41,18.1 270 top
IC4  65.72,54.61 180 top
IC5  18.41,53.34 90 top
IC6  18.41,31.11 90 top
IC7  18.41,8.57 90 top
IC8  79.38,53.02 180 top
IC9  46.35,57.15 90 top
IC10  46.35,34.92 90 top
IC11  46.35,12.38 90 top
JP1  81.92,65.72 0 top
JP2  63.82,4.13 0 top
JP3  82.23,4.13 0 top
JP4  5.71,40.96 90 top
JP5  5.71,18.41 90 top
JP6  5.71,63.18 90 top
LED1  89.53,51.44 270 top
LED2  74.93,6.35 270 top
R1  12.06,61.91 0 top
R2  12.06,64.14 0 top
R3  12.06,39.69 0 top
R4  12.06,41.91 0 top
R5  12.06,17.14 0 top
R6  12.06,19.37 0 top
R7  18.41,66.67 180 top
R8  18.41,44.45 180 top
R9  18.41,21.91 180 top
R10  69.53,54.61 270 top
R11  26.35,53.34 270 top
R12  26.35,31.11 270 top
R13  26.35,8.57 270 top
R14  19.68,49.53 180 top
R15  19.68,27.3 180 top
R16  19.68,4.76 180 top
R17  9.53,49.53 180 top
R18  9.53,27.3 180 top
R19  9.53,4.76 180 top
R20  89.53,49.53 0 top
R21  53.02,57.15 90 top
R22  53.02,34.92 90 top
R23  53.02,12.06 90 top
R24  38.1,65.41 270 top
R25  38.1,43.18 270 top
R26  38.1,20.64 270 top
R27  39.69,60.96 270 top
R28  39.69,38.73 270 top
R29  39.69,16.19 270 top
R30  42.86,65.41 90 top
R31  42.86,43.18 90 top
R32  42.86,20.64 90 top
R33  90.17,10.48 270 top
R34  96.52,10.79 180 top
R35  80.96,21.91 180 top
R36  80.96,33.97 0 top
R37  96.52,24.77 180 top
R38  74.93,4.13 0 top
R39  96.52,38.73 180 top
R40  82.23,6.99 180 top
R41  82.23,9.21 180 top
S1  96.52,6.35 0 top
S2  96.52,20.32 0 top
S3  96.52,34.29 0 top
U1  33.02,57.15 0 top
U2  33.02,34.92 0 top
U3  33.02,12.38 0 top
U4  69.22,20.95 90 top
X1  86.04,21.27 270 top

### Tracks (layer width: path | path; a pad name or v marks a point on that pad's centre or on a via)
!DP_CS0  (via drill 0.6)
  Top 0.305: U4.55 60.45,24.95 54.93,30.48 54.93,43.18 52.39,45.72 46.04,45.72 45.09,46.67 44.45,46.67 40.64,50.48 v40.64,51.12
  Top 0.406: U1.5 v33.66,54.61
  Bottom 0.406: v33.66,54.61 37.15,54.61 v40.64,51.12
!DP_CS1  (via drill 0.6)
  Top 0.305: v40.64,28.89 40.64,28.26 42.86,26.04 58.42,26.04 60,24.45 U4.56
  Top 0.406: U2.5 v33.66,32.38
  Bottom 0.406: v33.66,32.38 37.15,32.38 v40.64,28.89
!DP_CS2  (via drill 0.6)
  Top 0.305: U4.57 59.83,23.95 54.93,19.05 54.93,7.3 50.8,3.17 42.23,3.17 40.64,4.76 v40.64,6.67
  Top 0.406: U3.5 v33.66,9.84
  Bottom 0.406: v33.66,9.84 37.47,9.84 v40.64,6.67
!HRESET  (via drill 0.6)
  Top 0.305: R33.1 91.97,11.53 v92.08,11.43
  Bottom 0.305: v92.08,11.43 92.08,14.92 93.34,16.19 93.34,46.67 80.64,59.37 80.64,65.72 JP1.12
!NRST  (via drill 0.6)
  Top 0.305: U4.14 73.21,21.45 v67.63,15.88 | v92.08,6.35 91.12,7.3 C41.1 R33.2
  Top 0.61: C41.1 91.02,7.3 S1.1 97.79,8.6 | 97.79,8.6 S1.2 | R34.1 97.57,8.82 97.79,8.6
  Bottom 0.305: v67.63,15.88 JP2.5 67.63,3.17 68.9,1.91 87.31,1.91 91.76,6.35 v92.08,6.35
+3V3  (via drill 0.6)
  Top 0.305: U4.75 59.09,14.96 C45.1 | U4.100 75.22,10.82 C51.1 | 77.42,30.86 C56.2 | U4.50 63.22,29.5 62.23,30.48 C50.1 | C57.2 C56.2 | C48.1 79.69,14.61 78.74,15.56 78.74,17.14 78.42,17.46 77.78,17.45 U4.6 | C43.1 78.74,18.1 78.74,19.68 78.47,19.95 U4.11 | 80.01,26.04 C49.1 78.74,25.08 78.74,24.45 78.25,23.95 U4.19 | U4.28 74.22,29.61 73.98,29.84 C44.1 | C56.2 77.15,28.89 75.56,27.3 75.56,25.72 75.83,25.45 U4.22
  Top 0.406: R27.2 39.37,59.27 39.37,50.16 v40.96,48.58 | v41.91,37.15 40.22,37.15 R28.2 39.69,37.47 39.37,37.15 39.37,27.94 v40.96,26.35 | C57.2 C44.1 | C42.1 C45.1 | v39.37,13.34 39.37,14.82 R29.2 | C51.1 75.25,10.16
  Top 0.61: v39.37,13.34 39.37,4.45 42.55,1.27 57.47,1.27 | 57.47,1.27 JP2.1 57.47,9.21 59.05,10.79 C42.1 | JP3.2 83.5,1.27 | 75.25,10.16 75.25,9.84 75.88,9.21 77.47,9.21 78.11,8.57 78.11,1.27 | C49.1 80.01,27.62 80.33,27.94 82.87,27.94 84.14,29.21 95.57,29.21 | C48.1 C43.1 | 95.25,13.02 80.33,13.02 80.01,13.34 C48.1 | 95.25,13.02 103.19,13.02 | IC8.5 81.79,51.87 C21.1 C28.1 86.04,51.43 | 86.04,51.43 LED1.A | C56.2 78.42,31.11 78.42,35.24 | 86.04,40.64 78.42,40.64 | 78.42,40.64 60.01,40.64 60.01,31.11 C50.1 | 86.04,51.43 86.04,40.64 | 95.25,40.64 103.19,40.64 103.19,29.21 | 95.25,40.64 86.04,40.64 | R39.2 95.47,40.42 95.25,40.64 | R37.2 95.47,29.11 95.57,29.21 | R34.2 95.47,12.8 95.25,13.02 | 57.47,1.27 78.11,1.27 | 78.11,1.27 83.5,1.27 | 83.5,1.27 103.19,1.27 103.19,13.02 | R36.2 82.02,35.14 81.92,35.24 78.42,35.24 | 78.42,40.64 78.42,35.24 | 103.19,29.21 103.19,13.02 | 95.57,29.21 103.19,29.21
  Bottom 0.406: v41.91,37.15 40.96,38.1 v40.96,48.58 | v40.96,26.35 40.96,14.92 v39.37,13.34
+5V
  Top 0.406: C4.1 25.08,42.23
  Top 0.61: IC1.7 22.54,63.5 C2.1 C14.2 | IC5.8 15.55,51.17 C22.1 17.78,47.31 25.08,47.31 | U1.14 C14.2 | C14.2 31.43,64.14 33.66,64.14 | 33.66,64.14 U1.12 33.66,56.52 34.92,55.24 U1.6 34.92,51.44 35.56,50.8 35.56,47.31 | 25.08,47.31 35.56,47.31 | 35.56,47.31 41.27,47.31 42.86,45.72 44.77,45.72 45.4,45.09 45.4,43.18 46.35,42.23 C39.1 IC10.12 | C38.1 48.26,64.45 50.48,66.67 60.01,66.67 | C24.1 15.24,29.21 | 15.24,29.21 IC6.8 | C16.2 31.43,41.91 33.34,41.91 33.66,41.59 U2.12 33.66,34.29 34.92,33.02 U2.6 34.92,28.89 35.56,28.26 35.56,25.08 | U2.14 C16.2 | C16.2 C4.1 22.54,41.27 IC2.7 | 15.24,29.21 15.24,26.67 16.83,25.08 25.08,25.08 | 25.08,25.08 35.56,25.08 | IC3.7 22.54,18.73 C6.1 | C6.1 C18.2 | C18.2 U3.14 | C18.2 31.43,19.37 33.34,19.37 33.66,19.05 U3.12 33.66,11.75 34.92,10.48 U3.6 34.92,6.67 35.56,6.03 35.56,3.17 34.92,2.54 16.83,2.54 15.24,4.13 C26.1 15.24,6.67 IC7.8 | IC11.12 C40.1 46.03,19.69 45.4,20.32 45.4,21.91 44.13,23.18 37.47,23.18 35.56,25.08 | JP1.4 JP1.2 64.05,66.99 C59.+ 63.27,66.67 C60.2 60.01,66.67 | 25.08,25.08 25.08,19.68 C6.1 | 25.08,42.23 25.08,47.31 | IC9.12 C38.1 | C38.1 46.04,64.45 45.72,64.77 45.72,67.63 45.4,67.94 33.66,67.94 33.66,64.14 | IC8.3 78.42,53.34 78.74,53.02 80.01,53.02 80.33,53.34 IC8.1 80.33,54.29 80.96,54.93 C9.1 C10.1 80.96,62.23 71.12,62.23 | IC4.8 67.98,52.01 R10.2 70.39,53.56 71.12,54.29 71.12,62.23 | 60.01,66.67 60.01,62.23 71.12,62.23
-5V  (via drill 0.6)
  Top 0.406: 15.56,60.96 IC1.4 | 15.24,16.19 IC3.4 | 15.56,38.73 IC2.4
  Top 0.61: IC1.4 15.55,60.7 C3.1 19.36,55.24 IC5.4 | C15.2 32.07,50.48 31.11,51.44 U1.3 v31.11,55.88 22.86,55.88 22.23,55.24 IC5.4 | C23.1 21.02,56.84 IC5.4 | C29.1 IC9.5 | IC2.4 15.55,38.48 C5.1 15.55,36.52 19.05,33.02 IC6.4 | IC6.4 21.02,34.55 C25.1 | IC10.5 C30.1 46.99,31.43 46.35,32.07 v40.64,32.07 | IC6.4 22.23,33.02 22.86,33.66 v31.11,33.66 U2.3 31.11,28.89 32.07,27.94 C17.2 | C31.1 IC11.5 46.99,9.21 46.35,9.84 v40.64,9.84 | C19.2 32.07,5.39 31.11,6.35 U3.3 v31.11,11.11 22.54,11.11 21.91,10.48 IC7.4 | IC3.4 15.55,15.93 C7.1 15.55,13.97 19.05,10.48 IC7.4 | IC7.4 21.02,12.01 C27.1 | 15.24,16.19 14.61,16.19 13.97,15.56 12.7,15.56 11.43,14.29 2.54,14.29 2.54,37.15 | 2.54,37.15 11.43,37.15 12.38,38.1 13.97,38.1 14.61,38.73 15.56,38.73 | 2.54,37.15 2.54,59.69 11.43,59.69 12.38,60.64 14.29,60.64 14.61,60.96 15.56,60.96 | C29.1 46.99,53.66 46.35,54.29 v40.64,54.29 | IC4.5 63.82,49.76 C8.- 62,47.94 47.62,47.94 46.99,48.58 C29.1
  Bottom 0.61: v31.11,55.88 39.05,55.88 v40.64,54.29 | v40.64,32.07 39.05,33.66 v31.11,33.66 | v40.64,9.84 39.37,11.11 v31.11,11.11
BOOT0  (via drill 0.6)
  Top 0.305: U4.94 72.22,9.03 v71.44,8.26 | JP3.1 80.96,6.77 R40.2 R41.2
  Bottom 0.305: v71.44,8.26 76.83,8.26 JP3.1
BT_START  (via drill 0.6)
  Top 0.305: U4.1 77.12,14.96 v78.11,13.97 | v90.17,22.86 C58.1
  Top 0.61: 97.79,22.57 S2.1 91.02,21.27 C58.1 | 97.79,22.57 S2.2 | R37.1 97.57,22.79 97.79,22.57
  Bottom 0.305: v78.11,13.97 81.28,13.97 v90.17,22.86
BT_STOP  (via drill 0.6)
  Top 0.305: C61.1 v87.95,35.24 | U4.2 74.72,15.46 v74.3,15.88
  Top 0.61: 97.79,36.54 S3.1 91.02,35.24 C61.1 | 97.79,36.54 S3.2 | R39.1 97.57,36.76 97.79,36.54
  Bottom 0.305: v87.95,35.24 87.95,25.72 78.11,15.88 v74.3,15.88
CH0  (via drill 0.6)
  Top 0.305: R30.2 43.4,66.46 | U4.34 71.22,31.97 v71.12,32.07
  Top 0.61: 43.4,66.46 44.45,65.41 v44.45,64.45
  Bottom 0.61: v44.45,64.45 48.58,60.33 48.58,41.59 56.52,33.66 70.17,33.66 71.12,32.7 v71.12,32.07
CH1  (via drill 0.6)
  Top 0.305: U4.35 70.72,30.89 v69.53,32.07
  Top 0.61: v44.77,41.91 44.77,42.55 43.5,43.81 43.28,43.81 R31.2
  Bottom 0.61: v44.77,41.91 54.61,32.07 v69.53,32.07
CH2  (via drill 0.6)
  Top 0.305: U4.36 70.22,29.8 v69.53,30.48
  Top 0.61: R32.2 43.08,21.69 44.13,20.64 44.13,20 v44.45,19.68
  Bottom 0.61: v44.45,19.68 49.21,19.68 60.01,30.48 v69.53,30.48
DP_CLK  (via drill 0.6)
  Top 0.305: U4.30 73.22,27.5 69.22,23.5 v66.36,23.5
  Top 0.406: U1.7 36.2,51.44 36.83,50.8 36.83,48.9 v37.15,48.58 | v36.2,35.24 U2.7 36.2,28.89 36.83,28.26 36.83,26.67 v37.15,26.35 39.37,24.13 55.88,24.13 v56.52,23.5 | v36.2,12.7 U3.7
  Bottom 0.406: v36.2,35.24 37.47,36.51 37.47,48.26 v37.15,48.58 | v36.2,12.7 36.2,13.02 34.29,14.92 34.29,23.5 v37.15,26.35 | v56.52,23.5 v66.36,23.5
DP_SDI  (via drill 0.6)
  Top 0.305: U4.32 72.22,27.45 69.53,24.77 v64.45,24.77
  Top 0.406: U1.11 34.92,60.33 38.42,56.83 38.42,49.21 v39.05,48.58 | v39.05,46.04 34.92,46.04 U2.11 34.92,38.1 38.42,34.61 38.42,26.99 v39.05,26.35 40.32,25.08 57.47,25.08 v57.78,24.77 | U3.11 34.92,21.59 v35.88,22.54
  Bottom 0.406: v39.05,48.58 v39.05,46.04 | v35.88,22.54 35.88,23.18 v39.05,26.35 | v57.78,24.77 v64.45,24.77
GND  (via drill 0.6)
  Top 0.305: C57.1 C56.1 | U4.74 62.76,15.46 62.87,15.56 | U4.99 74.72,14.5 74.61,14.61 | U4.10 75.65,19.45 75.56,19.37 | U4.20 75.57,24.45 75.56,24.45 | U4.27 74.72,27.09 74.61,26.99 | U4.37 69.72,27.17 69.53,26.99
  Top 0.406: C22.2 R17.1 | R18.1 C24.2 | R19.1 C26.2
  Top 0.61: C15.1 33.97,49.85 32.38,51.44 U1.4 | C17.1 33.97,27.62 32.38,29.21 U2.4 | C19.1 33.97,5.08 32.38,6.67 U3.4 | C52.1 C47.1 | C8.+ 66.36,49.53 65.09,50.8 IC4.6 | IC8.2 79.38,55.88 C9.2
  Top 1.27: v54.93,65.41 57.15,65.41
  Bottom 1.27: v54.93,65.41 57.47,65.41
  other vias: 30.48,5.4 30.48,27.62 30.48,50.16 26.67,23.5 28.26,23.5 26.67,46.04 28.26,46.04 26.67,58.74 28.26,58.74 29.84,58.74 29.21,54.61 29.21,32.38 23.5,23.5 21.91,23.5 20.32,23.5 23.5,46.04 21.91,46.04 20.32,46.04 29.84,23.5 29.84,46.04 25.72,66.36 27.3,66.36 28.89,66.36 29.21,9.84 26.67,36.2 28.26,36.2 29.84,36.2 26.67,14.29 28.26,14.29 29.84,14.29 36.2,44.77 36.2,43.18 35.56,66.36 35.56,64.77 45.09,27.62 51.12,27.62 52.7,27.62 54.29,27.62 44.45,5.71 57.78,65.41 57.78,63.82 57.78,62.23 54.93,63.82 54.93,62.23 57.78,60.64 54.93,60.64 45.09,49.85 45.09,48.26 44.45,4.13 54.29,22.86 54.29,21.27 69.85,15.88 71.44,15.88 59.69,21.91 59.69,20.32 72.07,4.13 83.82,26.99 83.82,23.81 64.14,20.95 65.72,20.95 83.82,25.4 80.33,38.73 82.23,38.73 84.14,38.73 61.91,38.73 63.82,38.73 65.72,38.73 90.17,27.62 90.17,26.04 90.17,24.45
  pour Bottom: 0,69.85 55.88,69.85 55.88,0 0,0
  pour Top: 0,69.85 55.88,69.85 55.88,0 0,0
  pour Top: 56.83,69.85 105.09,69.85 105.09,0 56.83,0
  pour Bottom: 56.83,69.85 105.09,69.85 105.09,0 56.83,0
HBOOT  (via drill 0.6)
  Top 0.305: v85.41,9.21 R41.1
  Bottom 0.305: JP1.11 79.38,59.37 92.39,46.35 92.39,16.19 v85.41,9.21
IN0+
  Top 0.406: R1.1 JP6.1
IN0-
  Top 0.406: R2.1 6.03,64.14 JP6.2
IN1+
  Top 0.406: R3.1 JP4.1
IN1-
  Top 0.406: R4.1 6.03,41.91 JP4.2
IN2+
  Top 0.406: R5.1 JP5.1
IN2-
  Top 0.406: R6.1 6.03,19.37 JP5.2
LED_STATUS
  Top 0.305: U4.96 73.22,6.38 LED2.A
N$1
  Top 0.406: R2.2 13.97,64.14 14.61,63.5 IC1.2
N$2
  Top 0.406: R7.1 19.47,66.32 IC1.8
N$3
  Top 0.406: IC1.1 15.88,64.77 17.14,66.04 17.14,66.46 R7.2
N$4
  Top 0.406: R1.2 14.29,61.91 14.61,62.23 IC1.3
N$5
  Top 0.305: X1.1 86.04,24.45 83.5,21.91 R35.1 81.92,21.91 80.33,23.5 80.33,23.82 C55.1
N$6
  Top 0.406: IC9.8 50.8,52.7 53.02,54.93 R21.1
N$7
  Top 0.406: R21.2 C32.1 50.87,61.91 IC9.9
N$8
  Top 0.406: IC9.16 41.91,62.87 C35.1
  Top 0.61: R24.2 38.2,64.45 39.69,64.45 | 39.69,64.45 C35.1 | R27.1 39.69,64.45
N$9
  Top 0.305: U4.13 78.96,20.95 R35.2
N$10
  Top 0.406: IC9.14 44.45,62.77 R30.1
N$11
  Top 0.61: IC4.2 66.36,59.46 C1.+
N$12
  Top 0.406: R22.1 53.02,32.45 IC10.8
N$13
  Top 0.406: IC10.9 52.96,39.62 C33.1 R22.2
N$14
  Top 0.406: IC2.2 14.61,41.27 13.97,41.91 R4.2
N$15
  Top 0.406: IC2.8 21.02,42.9 R8.1
N$16
  Top 0.406: IC2.1 15.81,42.9 R8.2
N$17
  Top 0.406: IC2.3 14.92,40.01 14.61,39.69 R3.2
N$18
  Top 0.406: 40.22,42.13 C36.1 41.91,40.64 IC10.16
  Top 0.61: R25.2 38.2,42.23 39.69,42.23 | 39.69,42.23 C36.1 | R28.1 39.69,42.23
N$19
  Top 0.406: IC10.14 44.45,40.54 R31.1
N$20
  Top 0.61: IC4.4 63.82,59.46 C1.-
N$21
  Top 0.305: U4.49 63.72,29.74 64.45,30.48 C53.2
N$22
  Top 0.406: R23.1 53.02,9.91 IC11.8
N$23
  Top 0.406: IC11.9 50.8,17.14 C34.1 R23.2
N$24
  Top 0.406: R6.2 13.97,19.37 14.61,18.73 IC3.2
N$25
  Top 0.406: R9.1 19.47,21.55 IC3.8
N$26
  Top 0.406: IC3.1 15.88,20 17.14,21.27 17.14,21.69 R9.2
N$27
  Top 0.406: IC3.3 14.61,17.46 14.29,17.14 R5.2
N$28
  Top 0.406: IC11.16 41.91,18.1 C37.1
  Top 0.61: R26.2 39.69,19.59 | 39.69,19.59 40.22,19.59 C37.1 | R29.1 39.69,19.59
N$29
  Top 0.406: IC11.14 44.45,18 R32.1
N$30
  Top 0.61: IC4.1 67.98,57.21 R10.1
N$31  (via drill 0.6)
  Top 0.406: U1.2 29.84,51.12 29.21,50.48 29.21,49.53 C11.2 28.89,48.58 28.57,48.26 22.01,48.26 R14.1 20.74,51.16 IC5.1 v23.18,51.44 | U1.16 25.55,61.75 v24.77,60.96
  Bottom 0.406: v24.77,60.96 24.77,53.02 v23.18,51.44
N$32  (via drill 0.6)
  Top 0.406: IC5.3 v23.5,53.98 | v23.5,62.23 IC1.6
  Bottom 0.406: v23.5,53.98 v23.5,62.23
N$33
  Top 0.406: C11.1 26.99,49.85 28.57,51.44 U1.1 28.31,52.29 R11.2 25.93,52.7 IC5.2
N$34
  Top 0.406: R14.2 18.41,49.53 18.41,52.7 17.14,53.98 IC5.6
N$35
  Top 0.61: C20.1 78.11,51.55 IC8.4
N$36  (via drill 0.6)
  Top 0.406: D1.3 9.06,54.44 10.16,53.34 10.79,53.34 | 10.79,53.34 11.91,53.34 D2.1 14.75,52.7 IC5.7 14.92,52.7 v13.65,51.44 | R17.2 8.47,49.75 9.53,50.8 10.16,50.8 10.79,51.44 10.79,53.34 | v43.18,49.85 IC9.2
  Bottom 0.406: v13.65,51.44 21.27,51.44 23.81,48.9 35.88,48.9 36.83,49.85 v43.18,49.85
N$37
  Top 0.305: U4.73 59.61,15.96 C46.2
N$40  (via drill 0.6)
  Top 0.406: v23.18,29.21 IC6.1 20.74,28.93 R15.1 22.01,26.04 28.57,26.04 28.89,26.35 C12.2 28.89,27.94 29.84,28.89 U2.2 | v24.77,38.73 25.4,39.37 28.42,39.37 U2.16
  Bottom 0.406: v23.18,29.21 23.5,29.21 24.77,30.48 v24.77,38.73
N$41  (via drill 0.6)
  Top 0.406: IC6.3 v23.5,31.75 | v23.5,40.01 IC2.6
  Bottom 0.406: v23.5,31.75 v23.5,40.01
N$42
  Top 0.406: C12.1 26.99,27.62 28.57,29.21 U2.1 26.61,30.32 R12.2 25.93,30.48 IC6.2
N$43
  Top 0.406: R15.2 18.63,30.26 17.14,31.75 IC6.6
N$44  (via drill 0.6)
  Top 0.406: 10.16,31.11 12.06,31.11 13.02,32.06 D4.1 14.75,30.48 IC6.7 14.92,30.48 v13.65,29.21 | 10.16,31.11 9.21,32.07 8.4,32.07 D3.3 | R18.2 8.47,27.84 9.21,28.57 9.84,28.57 10.48,29.21 10.48,30.8 10.16,31.11 | v43.18,27.62 IC10.2
  Bottom 0.406: v13.65,29.21 21.27,29.21 24.13,26.35 35.24,26.35 36.51,27.62 v43.18,27.62
N$47  (via drill 0.6)
  Top 0.406: v23.18,6.67 IC7.1 20.74,6.39 R16.1 22.01,3.49 28.57,3.49 28.89,3.81 C13.2 28.89,5.39 29.84,6.35 U3.2 | v24.77,16.19 25.4,16.83 28.42,16.83 U3.16
  Bottom 0.406: v23.18,6.67 23.5,6.67 24.77,7.94 v24.77,16.19
N$48  (via drill 0.6)
  Top 0.406: IC7.3 v23.5,9.21 | v23.5,17.46 IC3.6
  Bottom 0.406: v23.5,9.21 v23.5,17.46
N$49
  Top 0.406: C13.1 26.99,5.08 28.57,6.67 U3.1 28.31,7.52 R13.2 25.93,7.94 IC7.2
N$50
  Top 0.406: R16.2 18.63,7.72 17.14,9.21 IC7.6
N$51  (via drill 0.6)
  Top 0.406: 10.48,8.57 12.06,8.57 13.02,9.52 D6.1 14.75,7.94 IC7.7 14.92,7.94 v13.65,6.67 | 10.48,8.57 10.16,8.57 9.21,9.53 8.4,9.53 D5.3 | R19.2 8.47,5.3 9.21,6.03 9.84,6.03 10.48,6.67 10.48,8.57 | v41.91,5.4 42.23,5.4 43.18,6.35 IC11.2
  Bottom 0.406: v13.65,6.67 21.27,6.67 23.81,4.13 40.64,4.13 v41.91,5.4
N$54
  Top 0.305: U4.12 80.01,20.45 | C54.1 80.01,20.45 | 80.01,20.45 80.02,20.45 83.69,20.45 86.04,18.1 X1.2
N$56
  Top 0.61: R20.2 90.59,50.74 LED1.C
N$57
  Top 0.305: R38.2 75.98,5.65 LED2.C
SWCLK
  Top 0.305: U4.76 63.22,12.73 60.01,9.53 JP2.2
SWDIO  (via drill 0.6)
  Top 0.305: U4.72 63.55,16.45 v64.14,15.88
  Bottom 0.305: v64.14,15.88 64.14,5.08 JP2.4
SWO
  Top 0.305: U4.89 69.72,4.58 JP2.6
UART_RX  (via drill 0.6)
  Top 0.305: U4.69 68.44,17.95 v73.34,22.86
  Bottom 0.305: v73.34,22.86 73.34,23.5 72.71,24.13 72.71,63.5 73.03,63.82 73.03,65.72 JP1.8
UART_TX  (via drill 0.6)
  Top 0.305: U4.68 62.59,18.45 62.87,18.73 67.31,18.73 73.34,24.77 v73.98,24.77
  Bottom 0.305: v73.98,24.77 73.98,61.91 75.56,63.5 75.56,65.72 JP1.10
VREF
  Top 0.305: C47.2 78.11,27.62 78.11,25.08 77.98,24.95 U4.21
  Top 0.406: R36.1 79.91,31.85 C52.2 C47.2

### Text on the board
Top: SEISM0.01